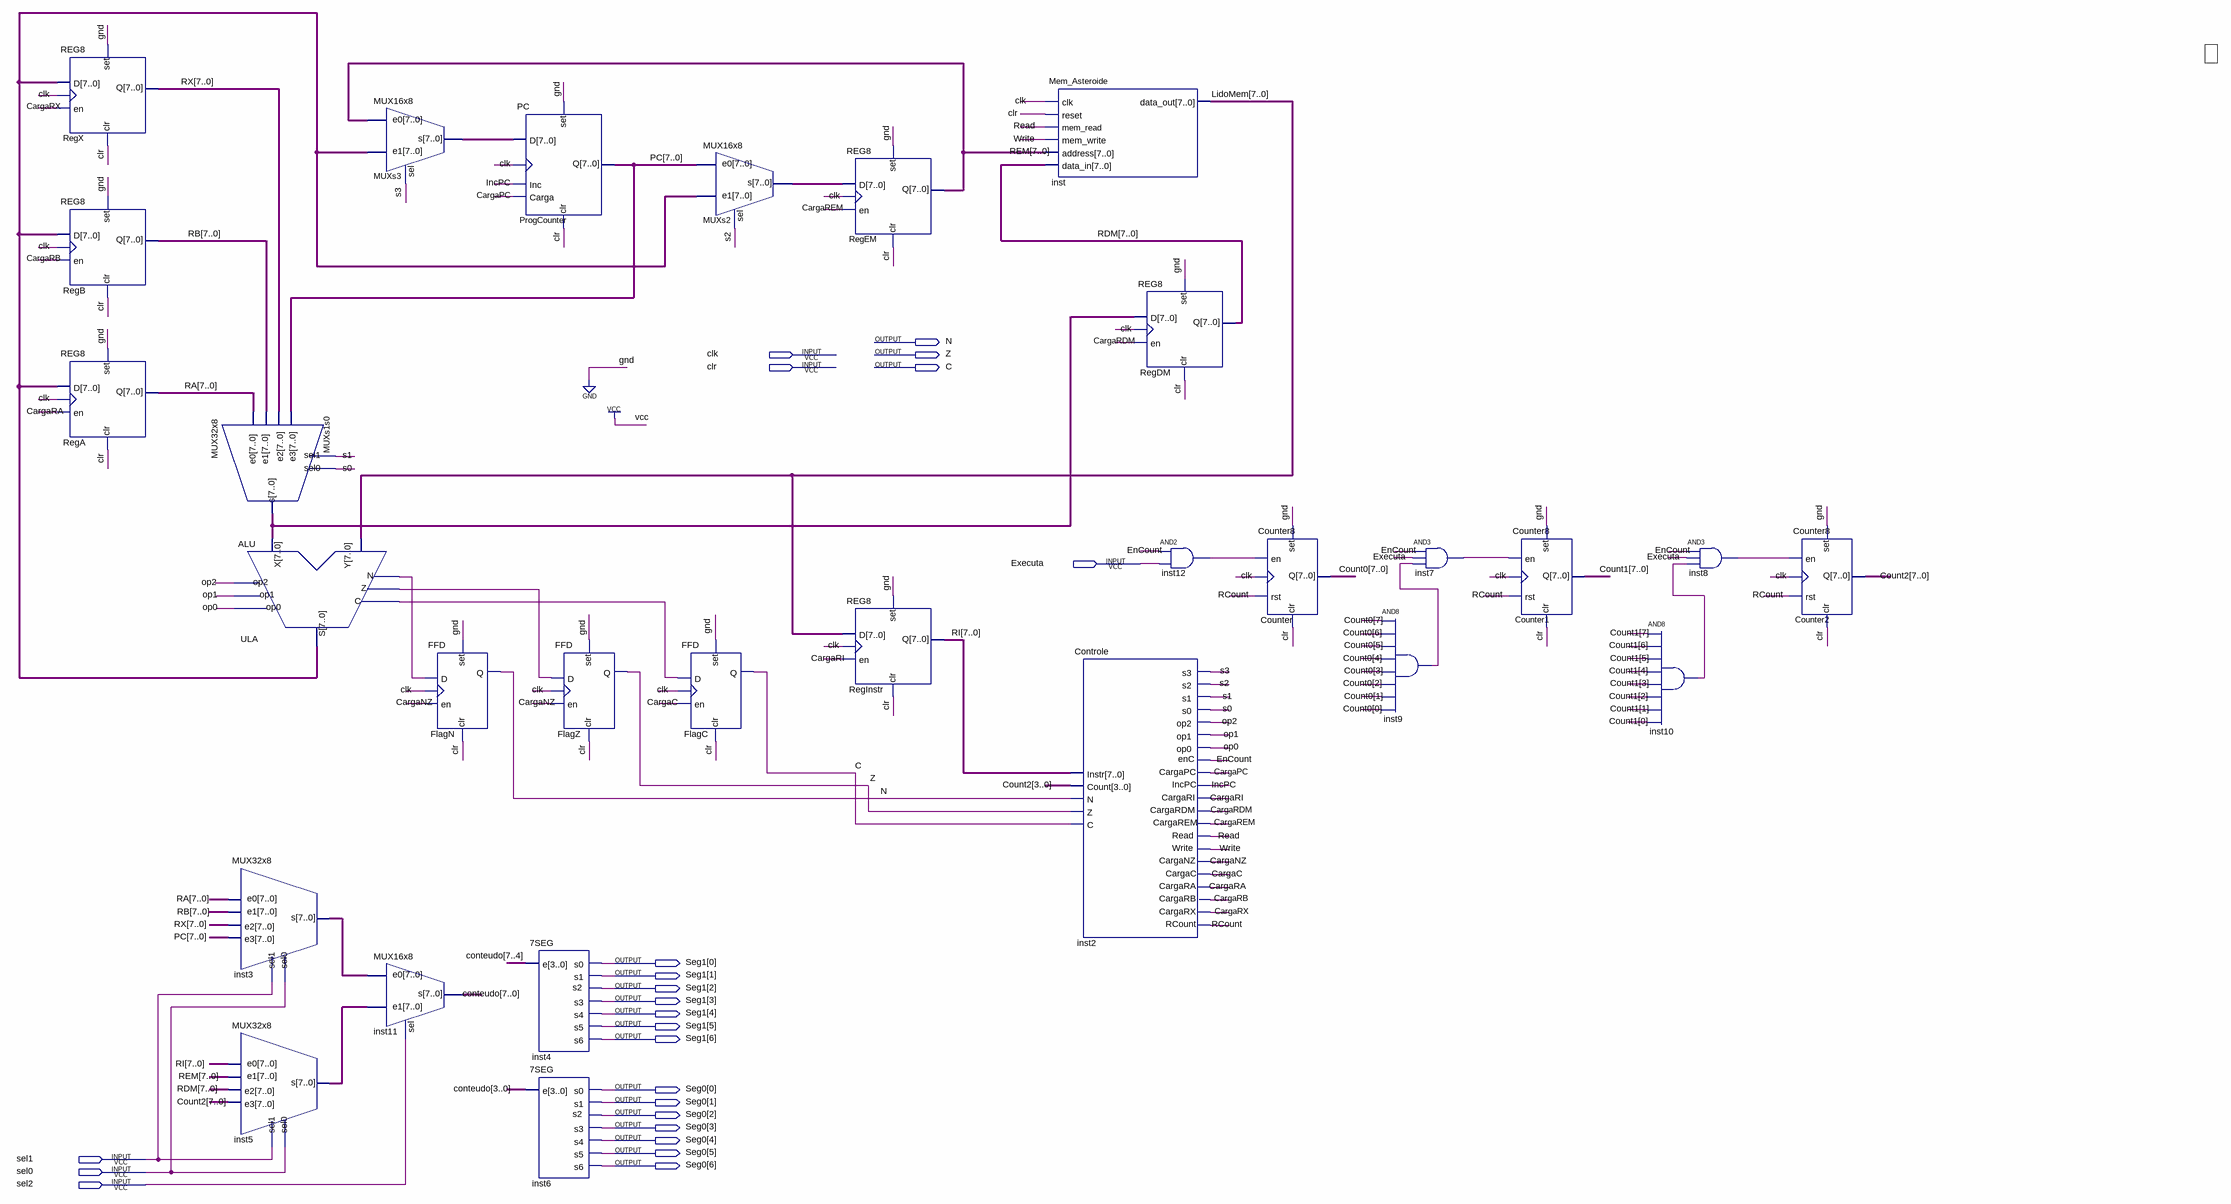
[diagram p0: schematic sheet]
// Quartus schematic Ramses.bdf as structural Verilog: 29 symbols, 23 pins
module Ramses (
  input  clk,
  input  clr,
  input  Executa,
  input  sel1,
  input  sel0,
  input  sel2,
  output N,
  output Z,
  output C,
  output [6:0] Seg1,
  output [6:0] Seg0
);

  wire CargaC, CargaNZ, CargaPC, CargaRA, CargaRB, CargaRDM, CargaREM, CargaRI, CargaRX, EnCount, IncPC,
       inst7_out, inst8_out, inst9_out, inst10_out, inst12_out, op0, op1, op2, RCount, Read, s0, s1, s2, s3,
       ULA_c, ULA_n, ULA_z, Write;
  wire [7:0] conteudo, Count0, Count1, Count2, inst3_s, inst5_s, LidoMem, MUXs1s0_s, MUXs2_s, MUXs3_s, PC,
       RA, RB, RDM, REM, RI, RX, ULA_s;

  REG8 RegX (.set(1'b0), .D(ULA_s), .clr(clr), .en(CargaRX), .clk(clk), .Q(RX));
  REG8 RegB (.set(1'b0), .D(ULA_s), .clr(clr), .en(CargaRB), .clk(clk), .Q(RB));
  REG8 RegA (.set(1'b0), .D(ULA_s), .clr(clr), .en(CargaRA), .clk(clk), .Q(RA));
  MUX32x8 MUXs1s0 (.e0(RA), .e1(RB), .e2(RX), .e3(PC), .sel0(s0), .sel1(s1), .s(MUXs1s0_s));
  ALU ULA (.X(MUXs1s0_s), .Y(LidoMem), .op2(op2), .op1(op1), .op0(op0), .S(ULA_s), .N(ULA_n), .Z(ULA_z), .C(ULA_c));
  MUX32x8 inst3 (.e0(RA), .e1(RB), .e2(RX), .e3(PC), .sel0(sel0), .sel1(sel1), .s(inst3_s));
  MUX32x8 inst5 (.e0(RI), .e1(REM), .e2(RDM), .e3(Count2), .sel0(sel0), .sel1(sel1), .s(inst5_s));
  MUX16x8 MUXs3 (.sel(s3), .e0(REM), .e1(ULA_s), .s(MUXs3_s));
  MUX16x8 inst11 (.sel(sel2), .e0(inst3_s), .e1(inst5_s), .s(conteudo));
  FFD FlagN (.set(1'b0), .D(ULA_n), .en(CargaNZ), .clr(clr), .clk(clk), .Q(N));
  PC ProgCounter (.D(MUXs3_s), .set(1'b0), .clr(clr), .Carga(CargaPC), .Inc(IncPC), .clk(clk), .Q(PC));
  \7SEG  inst4 (
    .e(conteudo[7:4]), .s3(Seg1[3]), .s0(Seg1[0]), .s4(Seg1[4]), .s1(Seg1[1]), .s5(Seg1[5]), .s2(Seg1[2]),
    .s6(Seg1[6]));
  \7SEG  inst6 (
    .e(conteudo[3:0]), .s3(Seg0[3]), .s0(Seg0[0]), .s4(Seg0[4]), .s1(Seg0[1]), .s5(Seg0[5]), .s2(Seg0[2]),
    .s6(Seg0[6]));
  FFD FlagZ (.set(1'b0), .D(ULA_z), .en(CargaNZ), .clr(clr), .clk(clk), .Q(Z));
  MUX16x8 MUXs2 (.sel(s2), .e0(PC), .e1(ULA_s), .s(MUXs2_s));
  FFD FlagC (.set(1'b0), .D(ULA_c), .en(CargaC), .clr(clr), .clk(clk), .Q(C));
  REG8 RegEM (.set(1'b0), .D(MUXs2_s), .clr(clr), .en(CargaREM), .clk(clk), .Q(REM));
  REG8 RegInstr (.set(1'b0), .D(LidoMem), .clr(clr), .en(CargaRI), .clk(clk), .Q(RI));
  Mem_Asteroide inst (
    .clk(clk), .reset(clr), .mem_read(Read), .mem_write(Write), .address(REM), .data_in(RDM),
    .data_out(LidoMem));
  Controle inst2 (
    .Instr(RI), .Count(Count2[3:0]), .N(N), .Z(Z), .C(C), .enC(EnCount), .s3(s3), .s2(s2), .s1(s1), .s0(s0),
    .op2(op2), .op1(op1), .op0(op0), .CargaREM(CargaREM), .Read(Read), .CargaPC(CargaPC), .IncPC(IncPC),
    .CargaRDM(CargaRDM), .Write(Write), .RCount(RCount), .CargaRI(CargaRI), .CargaC(CargaC),
    .CargaNZ(CargaNZ), .CargaRA(CargaRA), .CargaRB(CargaRB), .CargaRX(CargaRX));
  REG8 RegDM (.set(1'b0), .D(MUXs1s0_s), .clr(clr), .en(CargaRDM), .clk(clk), .Q(RDM));
  and inst12 (inst12_out, EnCount, Executa);
  Counter8 Counter (.en(inst12_out), .set(1'b0), .clr(clr), .rst(RCount), .clk(clk), .Q(Count0));
  and inst9 (inst9_out, Count0[7], Count0[6], Count0[5], Count0[4], Count0[3], Count0[2], Count0[1], Count0[0]);
  and inst7 (inst7_out, EnCount, Executa, inst9_out);
  Counter8 Counter1 (.en(inst7_out), .set(1'b0), .clr(clr), .rst(RCount), .clk(clk), .Q(Count1));
  and inst10 (inst10_out, Count1[7], Count1[6], Count1[5], Count1[4], Count1[3], Count1[2], Count1[1], Count1[0]);
  and inst8 (inst8_out, EnCount, Executa, inst10_out);
  Counter8 Counter2 (.en(inst8_out), .set(1'b0), .clr(clr), .rst(RCount), .clk(clk), .Q(Count2));
endmodule
